# EAGLE design JTAG20M-STLV2 (EAGLE 6.4)
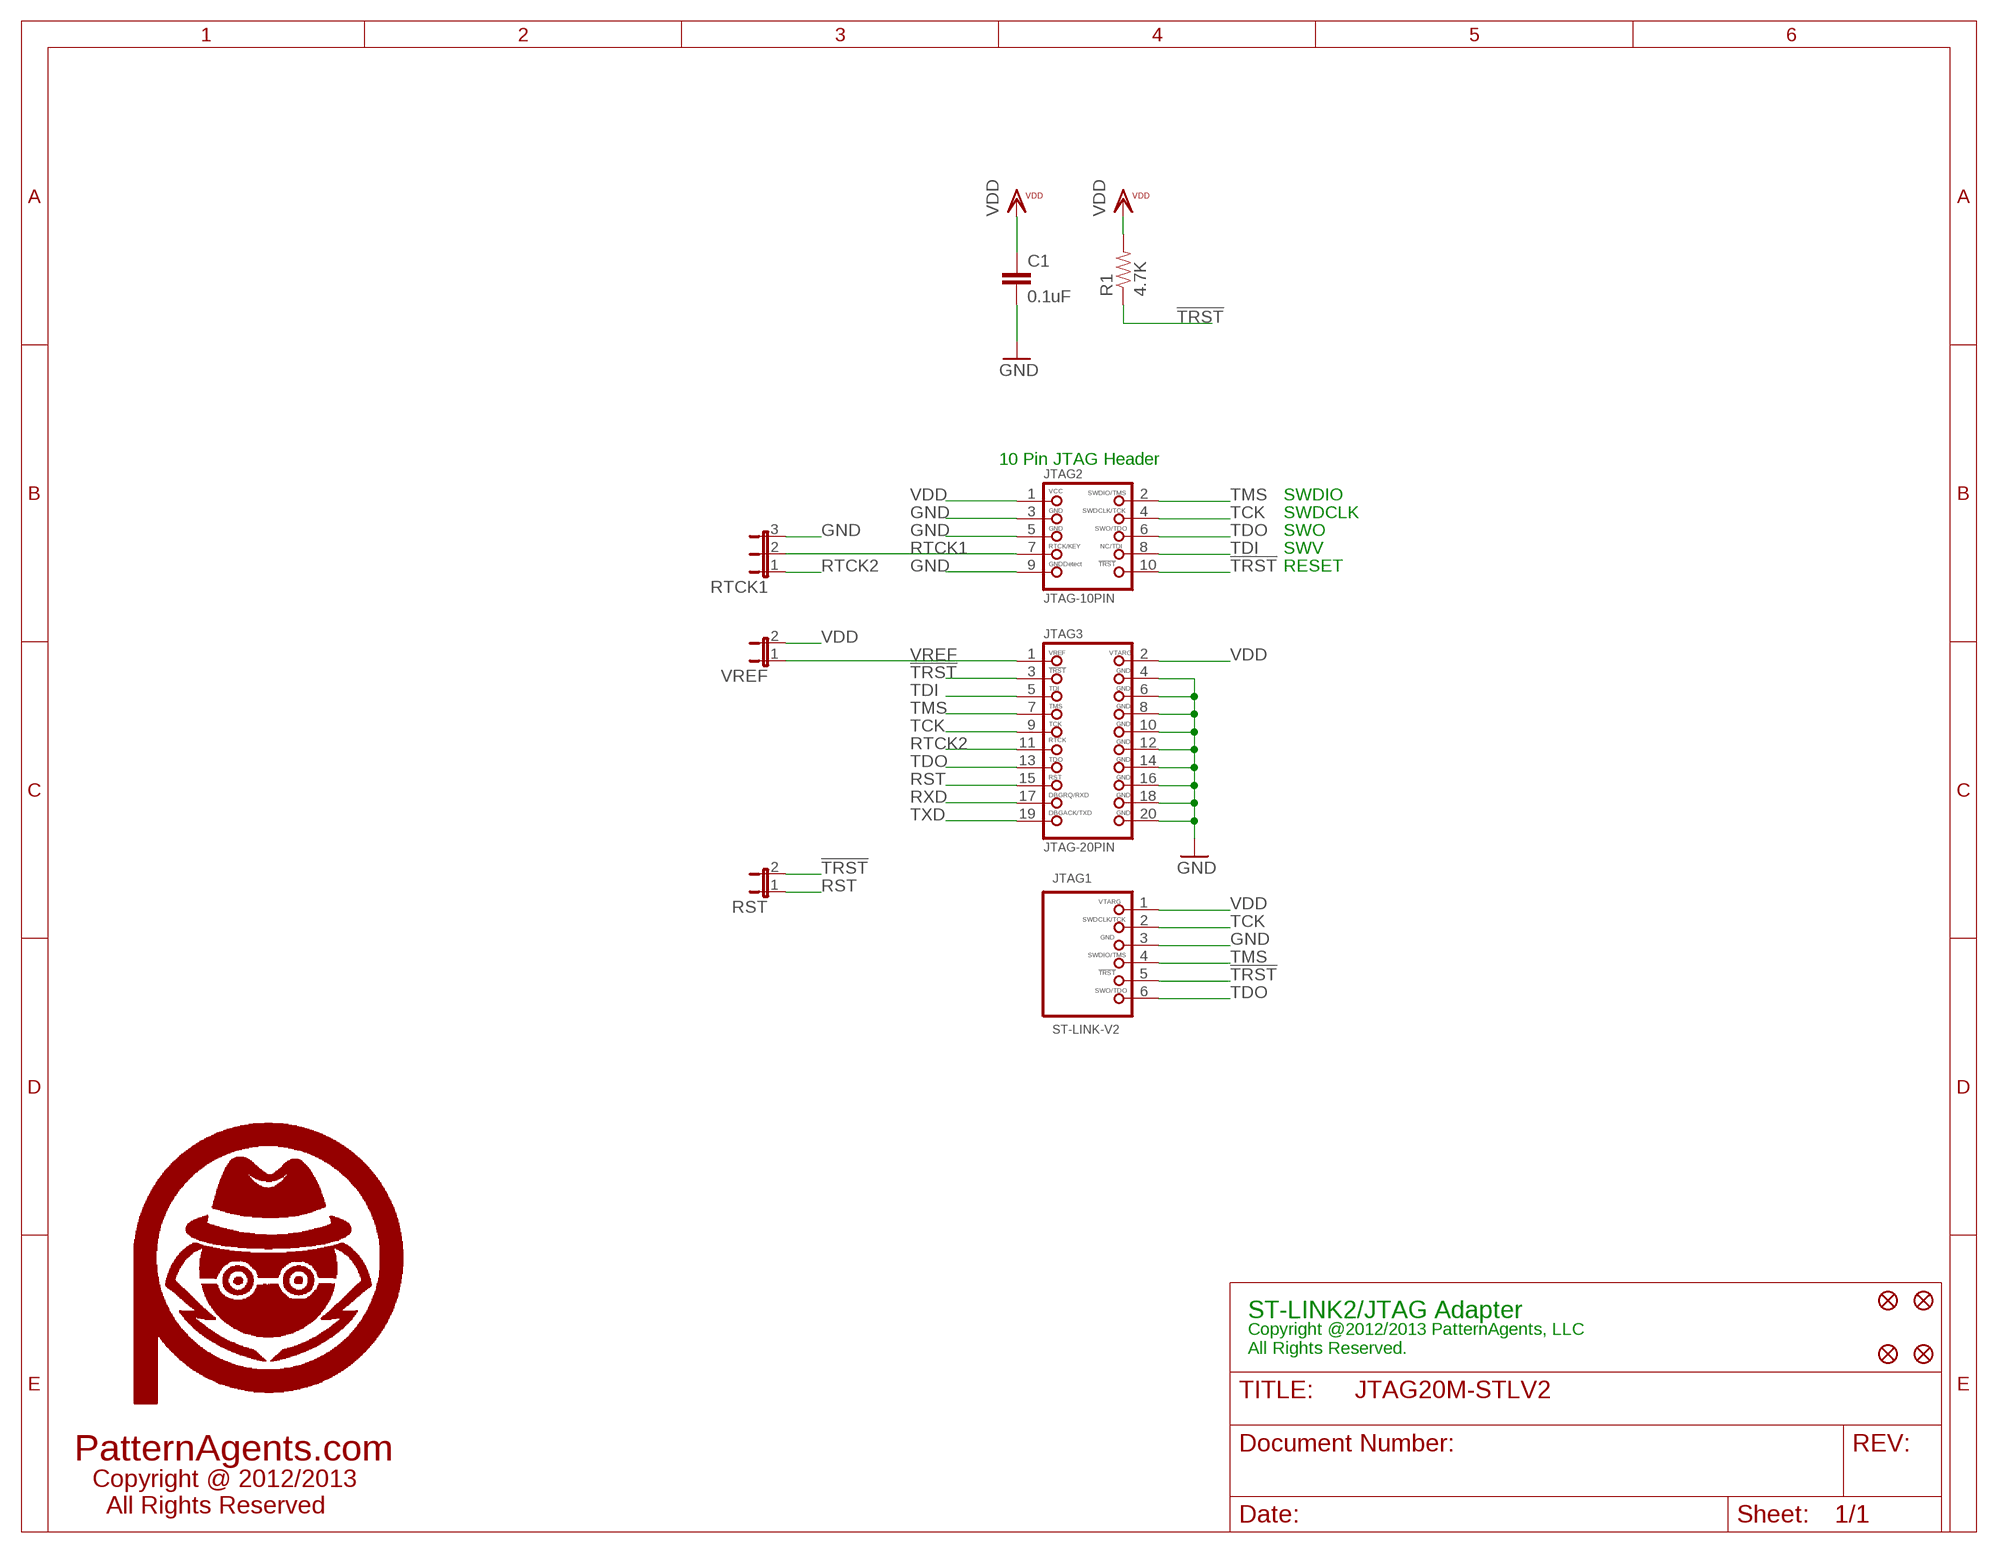
[diagram p0: schematic, sheet 1]

## Parts
C1  0.1uF  CAP0603-CAP  [0603-CAP]
FID1  FIDUCIAL1.5X3  [FIDUCIAL-1.5X3]
FID2  FIDUCIAL1.5X3  [FIDUCIAL-1.5X3]
FID3  FIDUCIAL1.5X3  [FIDUCIAL-1.5X3]
FID4  FIDUCIAL1.5X3  [FIDUCIAL-1.5X3]
JTAG1  ST-LINK-V2  [1X06_2.54MM_PTH]
JTAG2  JTAG-10PIN  JTAG-10PINSMD  [2X05_1.27MM_SMT]
JTAG3  JTAG-20PIN  [2X10_2.54MM_PTH]
R1  4.7K  RESISTOR_SFE0603-RES  [0603-RES]
RST  JUMPER2  [JUMPER2]
RTCK1  JUMPER3  [JUMPER3]
U$2  PA_LOGO_SYMLARGE  [PA_LOGO_AGENT_LRG_SYM]
VREF  JUMPER2  [JUMPER2]

## Nets
!TRST: JTAG1.5 JTAG2.10 JTAG3.3 R1.1 RST.2
GND: C1.2 JTAG1.3 JTAG2.3 JTAG2.5 JTAG2.9 JTAG3.4 JTAG3.6 JTAG3.8 JTAG3.10 JTAG3.12 JTAG3.14 JTAG3.16 JTAG3.18 JTAG3.20 RTCK1.3
RST: JTAG3.15 RST.1
RTCK1: JTAG2.7 RTCK1.2
RTCK2: JTAG3.11 RTCK1.1
RXD: JTAG3.17
TCK: JTAG1.2 JTAG2.4 JTAG3.9
TDI: JTAG2.8 JTAG3.5
TDO: JTAG1.6 JTAG2.6 JTAG3.13
TMS: JTAG1.4 JTAG2.2 JTAG3.7
TXD: JTAG3.19
VDD: C1.1 JTAG1.1 JTAG2.1 JTAG3.2 R1.2 VREF.2
VREF: JTAG3.1 VREF.1

## Notes on the sheet
- 10 Pin JTAG Header
- SWDIO
- SWDCLK
- SWO
- SWV
- RESET
- ST-LINK2/JTAG Adapter
- Copyright @2012/2013 PatternAgents, LLC
  All Rights Reserved.
- PatternAgents.com
- Copyright @ 2012/2013
    All Rights Reserved

## Library data of the parts
C1 = PatternAgents-Misc:CAP: Capacitor Standard 0603 ceramic capacitor, and 0.1" leaded capacitor.
FID1-FID4 = PatternAgents-Misc:FIDUCIAL: Fiducial Alignment Points Various fiducial points for machine vision alignment.
JTAG1 = PatternAgents_JTAG:ST-LINK-V2: ST-Link/V2 JTAG/SWD Connector LBR Source: http://www.patternagents.com Data Source : http://www.st.com/st-web-ui/static/active/en/resource/technical/document/user_manual/DM00039084.pdf THIS SOFTWARE IS PROVIDED BY THE CONTRIBUTORS "AS IS" AND WITHOUT ANY EXPRESS OR IMPLIED WARRANTIES, INCLUDING, BUT NOT LIMITED TO, THE IMPLIED WARRANTIES OF MERCHANTABILITY AND FITNESS FOR A PARTICULAR PURPOSE ARE DISCLAIMED. IN NO EVENT SHALL THE COPYRIGHT OWNER OR CONTRIBUTORS BE LIABLE FOR ANY DIRECT, INDIRECT, INCIDENTAL, SPECIAL, EXEMPLARY, OR CONSEQUENTIAL DAMAGES (INCLUDING, BUT NOT LIMITED TO, PROCUREMENT OF SUBSTITUTE GOODS OR SERVICES; LOSS OF USE, DATA, OR PROFITS; OR BUSINESS INTERRUPTION) HOWEVER CAUSED AND ON ANY THEORY OF LIABILITY, WHETHER IN CONTRACT, STRICT LIABILITY, OR TORT (INCLUDING NEGLIGENCE OR OTHERWISE) ARISING IN ANY WAY OUT OF THE USE OF THIS SOFTWARE, EVEN IF ADVISED OF THE POSSIBILITY OF SUCH DAMAGE.
JTAG2 = PatternAgents_JTAG:JTAG-10PIN: JTAG 10 Pin (SWD) Programming Connector LBR Source: http://www.patternagents.com THIS SOFTWARE IS PROVIDED BY THE CONTRIBUTORS "AS IS" AND WITHOUT ANY EXPRESS OR IMPLIED WARRANTIES, INCLUDING, BUT NOT LIMITED TO, THE IMPLIED WARRANTIES OF MERCHANTABILITY AND FITNESS FOR A PARTICULAR PURPOSE ARE DISCLAIMED. IN NO EVENT SHALL THE COPYRIGHT OWNER OR CONTRIBUTORS BE LIABLE FOR ANY DIRECT, INDIRECT, INCIDENTAL, SPECIAL, EXEMPLARY, OR CONSEQUENTIAL DAMAGES (INCLUDING, BUT NOT LIMITED TO, PROCUREMENT OF SUBSTITUTE GOODS OR SERVICES; LOSS OF USE, DATA, OR PROFITS; OR BUSINESS INTERRUPTION) HOWEVER CAUSED AND ON ANY THEORY OF LIABILITY, WHETHER IN CONTRACT, STRICT LIABILITY, OR TORT (INCLUDING NEGLIGENCE OR OTHERWISE) ARISING IN ANY WAY OUT OF THE USE OF THIS SOFTWARE, EVEN IF ADVISED OF THE POSSIBILITY OF SUCH DAMAGE.
JTAG3 = PatternAgents_JTAG:JTAG-20PIN: JTAG 20 Pin Programming Connector LBR Source: http://www.patternagents.com THIS SOFTWARE IS PROVIDED BY THE CONTRIBUTORS "AS IS" AND WITHOUT ANY EXPRESS OR IMPLIED WARRANTIES, INCLUDING, BUT NOT LIMITED TO, THE IMPLIED WARRANTIES OF MERCHANTABILITY AND FITNESS FOR A PARTICULAR PURPOSE ARE DISCLAIMED. IN NO EVENT SHALL THE COPYRIGHT OWNER OR CONTRIBUTORS BE LIABLE FOR ANY DIRECT, INDIRECT, INCIDENTAL, SPECIAL, EXEMPLARY, OR CONSEQUENTIAL DAMAGES (INCLUDING, BUT NOT LIMITED TO, PROCUREMENT OF SUBSTITUTE GOODS OR SERVICES; LOSS OF USE, DATA, OR PROFITS; OR BUSINESS INTERRUPTION) HOWEVER CAUSED AND ON ANY THEORY OF LIABILITY, WHETHER IN CONTRACT, STRICT LIABILITY, OR TORT (INCLUDING NEGLIGENCE OR OTHERWISE) ARISING IN ANY WAY OUT OF THE USE OF THIS SOFTWARE, EVEN IF ADVISED OF THE POSSIBILITY OF SUCH DAMAGE.
R1 = PatternAgents-Misc:RESISTOR_SFE: Resistor Basic schematic elements and footprints for 0603, 1206, and PTH resistors.
RST VREF = PatternAgents_JTAG:JUMPER2: Jumper 2 Pin LBR Source: http://www.patternagents.com THIS SOFTWARE IS PROVIDED BY THE CONTRIBUTORS "AS IS" AND WITHOUT ANY EXPRESS OR IMPLIED WARRANTIES, INCLUDING, BUT NOT LIMITED TO, THE IMPLIED WARRANTIES OF MERCHANTABILITY AND FITNESS FOR A PARTICULAR PURPOSE ARE DISCLAIMED. IN NO EVENT SHALL THE COPYRIGHT OWNER OR CONTRIBUTORS BE LIABLE FOR ANY DIRECT, INDIRECT, INCIDENTAL, SPECIAL, EXEMPLARY, OR CONSEQUENTIAL DAMAGES (INCLUDING, BUT NOT LIMITED TO, PROCUREMENT OF SUBSTITUTE GOODS OR SERVICES; LOSS OF USE, DATA, OR PROFITS; OR BUSINESS INTERRUPTION) HOWEVER CAUSED AND ON ANY THEORY OF LIABILITY, WHETHER IN CONTRACT, STRICT LIABILITY, OR TORT (INCLUDING NEGLIGENCE OR OTHERWISE) ARISING IN ANY WAY OUT OF THE USE OF THIS SOFTWARE, EVEN IF ADVISED OF THE POSSIBILITY OF SUCH DAMAGE.
RTCK1 = PatternAgents_JTAG:JUMPER3: Jumper 3 Pin LBR Source: http://www.patternagents.com THIS SOFTWARE IS PROVIDED BY THE CONTRIBUTORS "AS IS" AND WITHOUT ANY EXPRESS OR IMPLIED WARRANTIES, INCLUDING, BUT NOT LIMITED TO, THE IMPLIED WARRANTIES OF MERCHANTABILITY AND FITNESS FOR A PARTICULAR PURPOSE ARE DISCLAIMED. IN NO EVENT SHALL THE COPYRIGHT OWNER OR CONTRIBUTORS BE LIABLE FOR ANY DIRECT, INDIRECT, INCIDENTAL, SPECIAL, EXEMPLARY, OR CONSEQUENTIAL DAMAGES (INCLUDING, BUT NOT LIMITED TO, PROCUREMENT OF SUBSTITUTE GOODS OR SERVICES; LOSS OF USE, DATA, OR PROFITS; OR BUSINESS INTERRUPTION) HOWEVER CAUSED AND ON ANY THEORY OF LIABILITY, WHETHER IN CONTRACT, STRICT LIABILITY, OR TORT (INCLUDING NEGLIGENCE OR OTHERWISE) ARISING IN ANY WAY OUT OF THE USE OF THIS SOFTWARE, EVEN IF ADVISED OF THE POSSIBILITY OF SUCH DAMAGE.
U$2 = PatternAgents-Logos:PA_LOGO_SYM: PatternAgents Logo Symbol Trademark : PatternAgents, LLC Github : https://github.com/PatternAgents/PCB_Libraries License : http://creativecommons.org/licenses/by-sa/3.0/ (Creative Commons 3.0) THIS SOFTWARE IS PROVIDED BY THE CONTRIBUTORS "AS IS" AND WITHOUT ANY EXPRESS OR IMPLIED WARRANTIES, INCLUDING, BUT NOT LIMITED TO, THE IMPLIED WARRANTIES OF MERCHANTABILITY AND FITNESS FOR A PARTICULAR PURPOSE ARE DISCLAIMED. IN NO EVENT SHALL THE COPYRIGHT OWNER OR CONTRIBUTORS BE LIABLE FOR ANY DIRECT, INDIRECT, INCIDENTAL, SPECIAL, EXEMPLARY, OR CONSEQUENTIAL DAMAGES (INCLUDING, BUT NOT LIMITED TO, PROCUREMENT OF SUBSTITUTE GOODS OR SERVICES; LOSS OF USE, DATA, OR PROFITS; OR BUSINESS INTERRUPTION) HOWEVER CAUSED AND ON ANY THEORY OF LIABILITY, WHETHER IN CONTRACT, STRICT LIABILITY, OR TORT (INCLUDING NEGLIGENCE OR OTHERWISE) ARISING IN ANY WAY OUT OF THE USE OF THIS SOFTWARE, EVEN IF ADVISED OF THE POSSIBILITY OF SUCH DAMAGE.

## Board
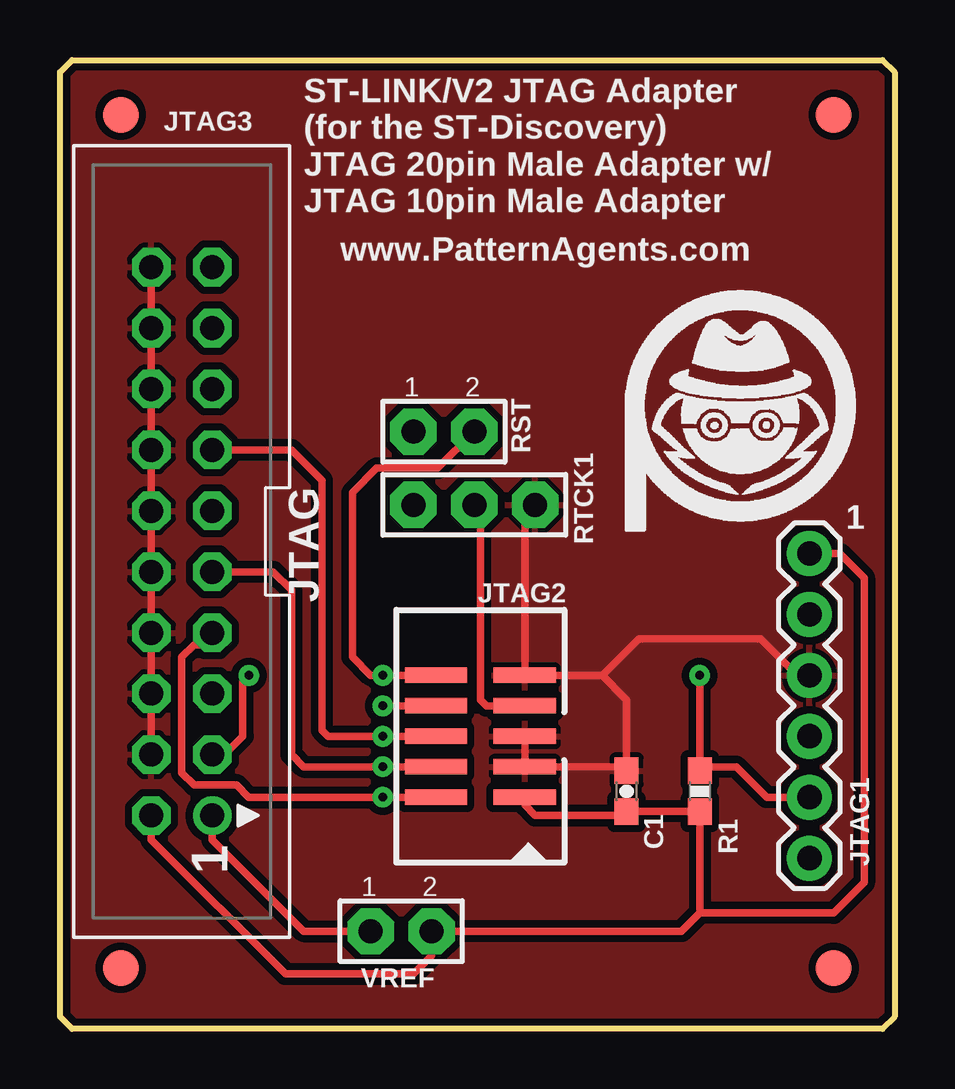
[diagram p1: board, top side]
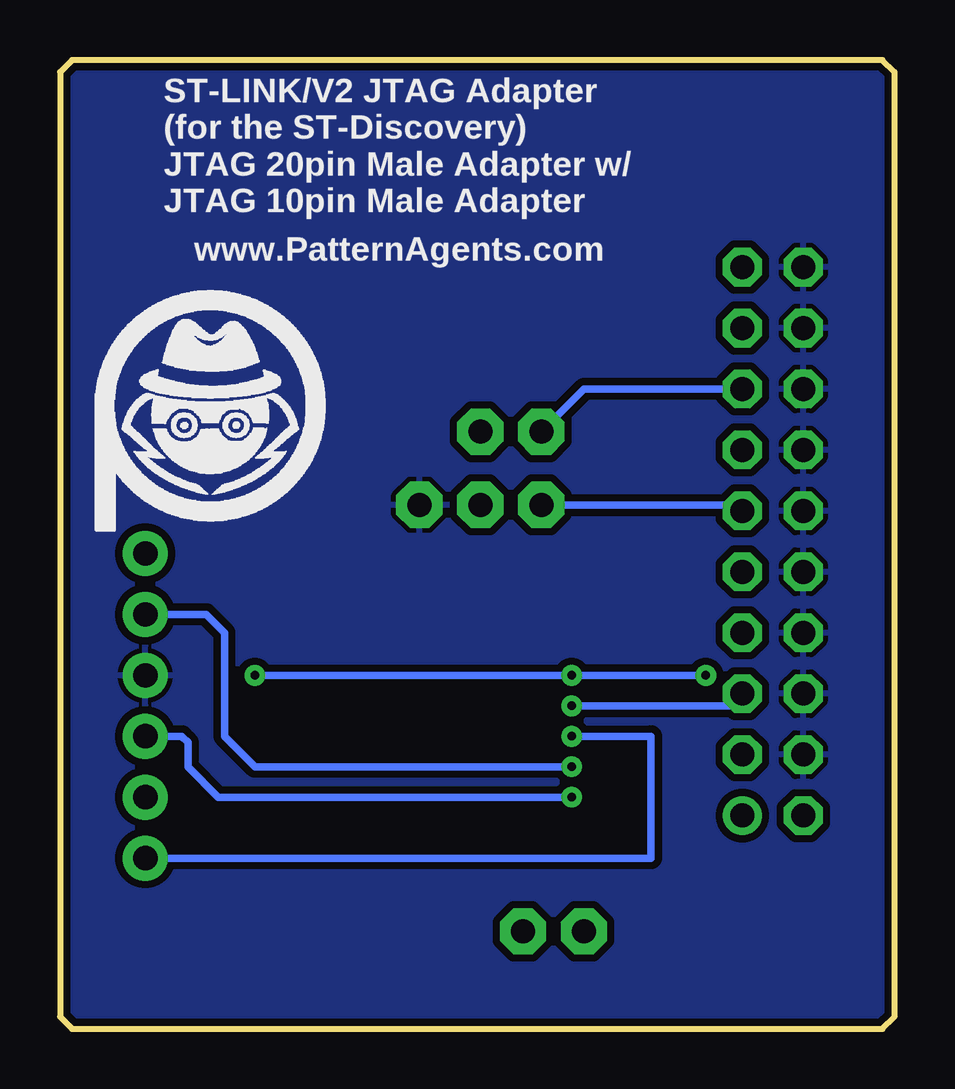
[diagram p2: board, bottom side, seen from below]

Size 34.8 x 40.39 mm. Coordinates in mm from the lower left corner, seen from the top.
Outline: 0.51,0 0,0.51 0,39.88 0.51,40.39 34.29,40.39 34.8,39.88 34.8,0.51 34.29,0 0.51,0
Copper layers (1*16): Top 0.035mm / dielectric 1.5mm / Bottom 0.035mm
Design rules "PatternAgents": minimum track width 8mil, minimum drill 14mil, track to track 8mil, track to pad 8mil, pad to pad 8mil, via to via 8mil, smd to smd 8mil, copper to edge 10mil, drill to drill 8mil, minimum pad ring 12mil, minimum via ring 10mil, stop-mask expansion 4mil, vias tented up to drill 25mil, thermal gap 8mil

### Footprints (pad centres in the part's own frame; a part is rotated, then mirrored left to right if it is on the bottom)
0603-CAP = smd 1.1 x 1: 1 -0.85,0; 2 0.85,0
FIDUCIAL-1.5X3 = smd 1.5 x 1.5: 1 0,0
1X06_2.54MM_PTH = drill 1.016 pad 1.88: 1 0,0; 2 2.54,0; 3 5.08,0; 4 7.62,0; 5 10.16,0; 6 12.7,0
2X05_1.27MM_SMT = smd 0.65 x 2.6: 1 -2.54,-1.85; 2 -2.54,1.85; 3 -1.27,-1.85; 4 -1.27,1.85; 5 0,-1.85; 6 0,1.85; 7 1.27,-1.85; 8 1.27,1.85; 9 2.54,-1.85; 10 2.54,1.85
2X10_2.54MM_PTH = drill 1: 1 -11.43,-1.27 | drill 1 octagon: 2 -11.43,1.27; 3 -8.89,-1.27; 4 -8.89,1.27; 5 -6.35,-1.27; 6 -6.35,1.27; 7 -3.81,-1.27; 8 -3.81,1.27; 9 -1.27,-1.27; 10 -1.27,1.27; 11 1.27,-1.27; 12 1.27,1.27; 13 3.81,-1.27; 14 3.81,1.27; 15 6.35,-1.27; 16 6.35,1.27; 17 8.89,-1.27; 18 8.89,1.27; 19 11.43,-1.27; 20 11.43,1.27
0603-RES = smd 1.1 x 1: 1 -0.85,0; 2 0.85,0
JUMPER2 = drill 1 pad 1.93 octagon: 1 2.54,0; 2 0,0
JUMPER3 = drill 1 pad 1.93 octagon: 1 -2.54,0; 2 0,0; 3 2.54,0

### Placement (x,y rotation side)
C1  23.62,9.91 90 top
FID1  32.26,2.54 270 top
FID2  32.26,38.1 270 top
FID3  2.54,2.54 270 top
FID4  2.54,38.1 270 top
JTAG1  31.24,19.81 270 top
JTAG2  17.53,12.19 90 top
JTAG3  5.08,20.32 90 top
R1  26.67,9.91 270 top
RST  17.27,24.89 180 top
RTCK1  17.27,21.84 0 top
U$1  PA_LOGO_SYMLARGE  [PA_LOGO_AGENT_LRG_SYM]  28.45,25.15 0 top
U$2  28.45,25.15 0 bottom
VREF  15.49,4.06 180 top

### Tracks (layer width: path | path; a pad name or v marks a point on that pad's centre or on a via)
!TRST  (via drill 0.36)
  Top 0.305: JTAG3.3 6.86,11.43 7.62,12.19 7.62,14.48 v7.87,14.73 | v13.46,14.73 JTAG2.10 12.95,14.73 12.19,15.49 12.19,22.35 13.21,23.37 15.75,23.37 RST.2 | JTAG1.5 29.46,9.65 28.19,10.92 26.84,10.92 R1.1 v26.67,14.73
  Bottom 0.305: v7.87,14.73 v13.46,14.73 v26.67,14.73
GND
  Top 0.305: RTCK1.3 19.38,21.41 JTAG2.9 22.61,14.73 | JTAG2.5 JTAG2.3 23.46,10.92 C1.2 23.62,13.72 22.61,14.73 | JTAG3.20 JTAG3.18 JTAG3.16 JTAG3.14 JTAG3.12 JTAG3.10 JTAG3.8 JTAG3.6 JTAG3.4 | JTAG1.3 30.73,14.73 29.21,16.26 24.13,16.26 22.61,14.73
  pour Bottom (isolate 0.305): 0,0 0,40.39 34.8,40.39 34.8,0
  pour Top (isolate 0.305): 0,0 0,40.39 34.8,40.39 34.8,0
RST
  Bottom 0.305: JTAG3.15 12.95,26.67 RST.1
RTCK1
  Top 0.305: JTAG2.7 17.78,13.46 17.53,13.72 17.53,21.59 RTCK1.2
RTCK2
  Bottom 0.305: RTCK1.1 6.6,21.84 JTAG3.11
TCK  (via drill 0.36)
  Top 0.305: JTAG3.9 8.89,19.05 9.65,18.29 9.65,11.43 10.16,10.92 v13.46,10.92 JTAG2.4
  Bottom 0.305: v13.46,10.92 26.67,10.92 27.94,12.19 27.94,16.51 28.7,17.27 JTAG1.2
TDI  (via drill 0.36)
  Top 0.305: JTAG2.8 v13.46,13.46
  Bottom 0.305: v13.46,13.46 6.86,13.46 JTAG3.5
TDO  (via drill 0.36)
  Top 0.305: JTAG3.13 9.65,24.13 10.92,22.86 10.92,12.45 11.18,12.19 v13.46,12.19 JTAG2.6
  Bottom 0.305: v13.46,12.19 10.16,12.19 10.16,7.11 JTAG1.6
TMS  (via drill 0.36)
  Top 0.305: JTAG3.7 5.84,16 5.59,16 5.08,15.49 5.08,10.67 5.59,10.16 7.37,10.16 7.87,9.65 v13.46,9.65 JTAG2.2
  Bottom 0.305: v13.46,9.65 28.19,9.65 29.46,10.92 29.46,11.94 29.72,12.19 JTAG1.4
VDD
  Top 0.305: JTAG3.2 3.81,7.87 9.4,2.29 14.73,2.29 15.49,3.05 VREF.2 25.91,4.06 26.54,4.7 26.67,4.83 | JTAG2.1 19.38,9.33 19.81,8.89 23.46,8.89 C1.1 R1.2 26.67,4.83 | JTAG1.1 32.51,19.81 33.53,18.8 33.53,6.1 32.26,4.83 26.67,4.83
VREF
  Top 0.305: JTAG3.1 6.35,7.87 10.16,4.06 VREF.1

### Text on the board
tPlace: ST-LINK/V2 JTAG Adapter / (for the ST-Discovery) / JTAG 20pin Male Adapter w/ / JTAG 10pin Male Adapter | www.PatternAgents.com | 1
bPlace: ST-LINK/V2 JTAG Adapter / (for the ST-Discovery) / JTAG 20pin Male Adapter w/ / JTAG 10pin Male Adapter | www.PatternAgents.com